# Altium schematic sheet TPS54531.SchDoc
size 292 x 193 mm; Author: Power Lin; SheetNumber: 1; SheetTotal: 1; Website: wiki-power.com
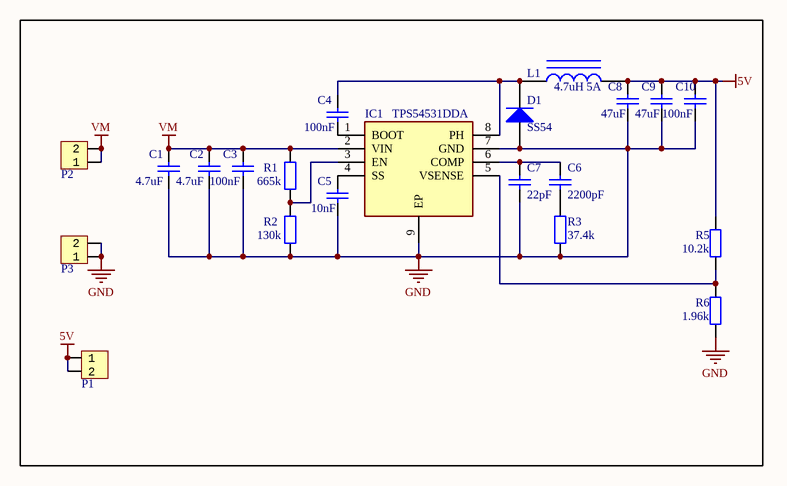
[diagram p0: TPS54531.SchDoc]

## Parts
C1  4.7uF  [CAP-0603]
C2  4.7uF  [CAP-0603]
C3  100nF  [CAP-0603]
C4  100nF  [CAP-0603]
C5  10nF  [CAP-0603]
C6  2200pF  [CAP-0603]
C7  22pF  [CAP-0603]
C8  47uF  [CAP-0603]
C9  47uF  [CAP-0603]
C10  100nF  [CAP-0603]
D1  SS54  [DO-214AB]
IC1  TPS54531DDA  [SOIC_8_PAD]
L1  4.7uH 5A  [L-10040]
P1  HDR1x2_2.54  [HDR1X2_2.54_180]  (value not drawn)
P2  HDR1x2_2.54  [HDR1X2_2.54_180]  (value not drawn)
P3  HDR1x2_2.54  [HDR1X2_2.54_180]  (value not drawn)
R1  665k  [R-0603]
R2  130k  [R-0603]
R3  37.4k  [R-0603]
R5  10.2k  [R-0603]
R6  1.96k  [R-0603]

## Nets
5V: C8.2 C9.2 C10.2 L1.2 P1.1 P1.2 R5.2
GND: C1.1 C2.1 C3.1 C5.1 C7.1 C8.1 C9.1 C10.1 D1.1(A) IC1.7(GND) IC1.9(EP) P3.1 P3.2 R2.1 R3.1 R6.1
VM: C1.2 C2.2 C3.2 IC1.2(VIN) P2.1 P2.2 R1.2
NetC4_1: C4.1 IC1.1(BOOT)
NetC4_2: C4.2 D1.2(K) IC1.8(PH) L1.1
NetC5_2: C5.2 IC1.4(SS)
NetC6_1: C6.1 R3.2
NetC6_2: C6.2 C7.2 IC1.6(COMP)
NetIC1_3: IC1.3(EN) R1.1 R2.2
NetIC1_5: IC1.5(VSENSE) R5.1 R6.2

## Notes on the sheet
- Author
- DocumentName
- ModifiedDate
- ProjectName
- SheetNumber
- SheetTotal
- Website
- Revision

## Library data of the parts
C1-C10 = CAP: 贴片电容; ComponentLink1Description: 供应商链接; ComponentLink1URL: http://www.szlcsc.com/product/details_53938.html; Package: 0402; Supplier: LC; SuppliersPartNumber: C52923
D1 = DIODE: 肖特基二极管; ComponentLink1Description: 供应商链接; ComponentLink1URL: http://www.szlcsc.com/product/details_23178.html; Package: SMA(DO-214AC); Supplier: LC; SuppliersPartNumber: C22452
IC1 = TPS54531DDA: 集成稳压芯片; Manufacturer_Name: Texas Instruments; Datasheet Link: http://www.ti.com/lit/gpn/tps54531; Height: 1.7mm; Manufacturer_Part_Number: TPS54531DDA; Mouser Part Number: 595-TPS54531DDA; Mouser Price/Stock: https://www.mouser.co.uk/ProductDetail/Texas-Instruments/TPS54531DDA?qs=jA5Ki6243omoJVKISZs%2FBg%3D%3D; Arrow Part Number: TPS54531DDA; Arrow Price/Stock: https://www.arrow.com/en/products/tps54531dda/texas-instruments
L1 = INDUCTOR: 电感; ComponentLink1Description: 供应商链接; ComponentLink1URL: http://www.szlcsc.com/product/details_33003.html; Package: 0402; Supplier: LC; SuppliersPartNumber: C32041
P1-P3 = HDR1x2_2.54: Header
R1-R3 R5 R6 = RES: 贴片电阻; Package: 0805; Supplier: LC; SuppliersPartNumber: C17798